# EAGLE design rpiabplusdogm128_1 (EAGLE 6.5.0)
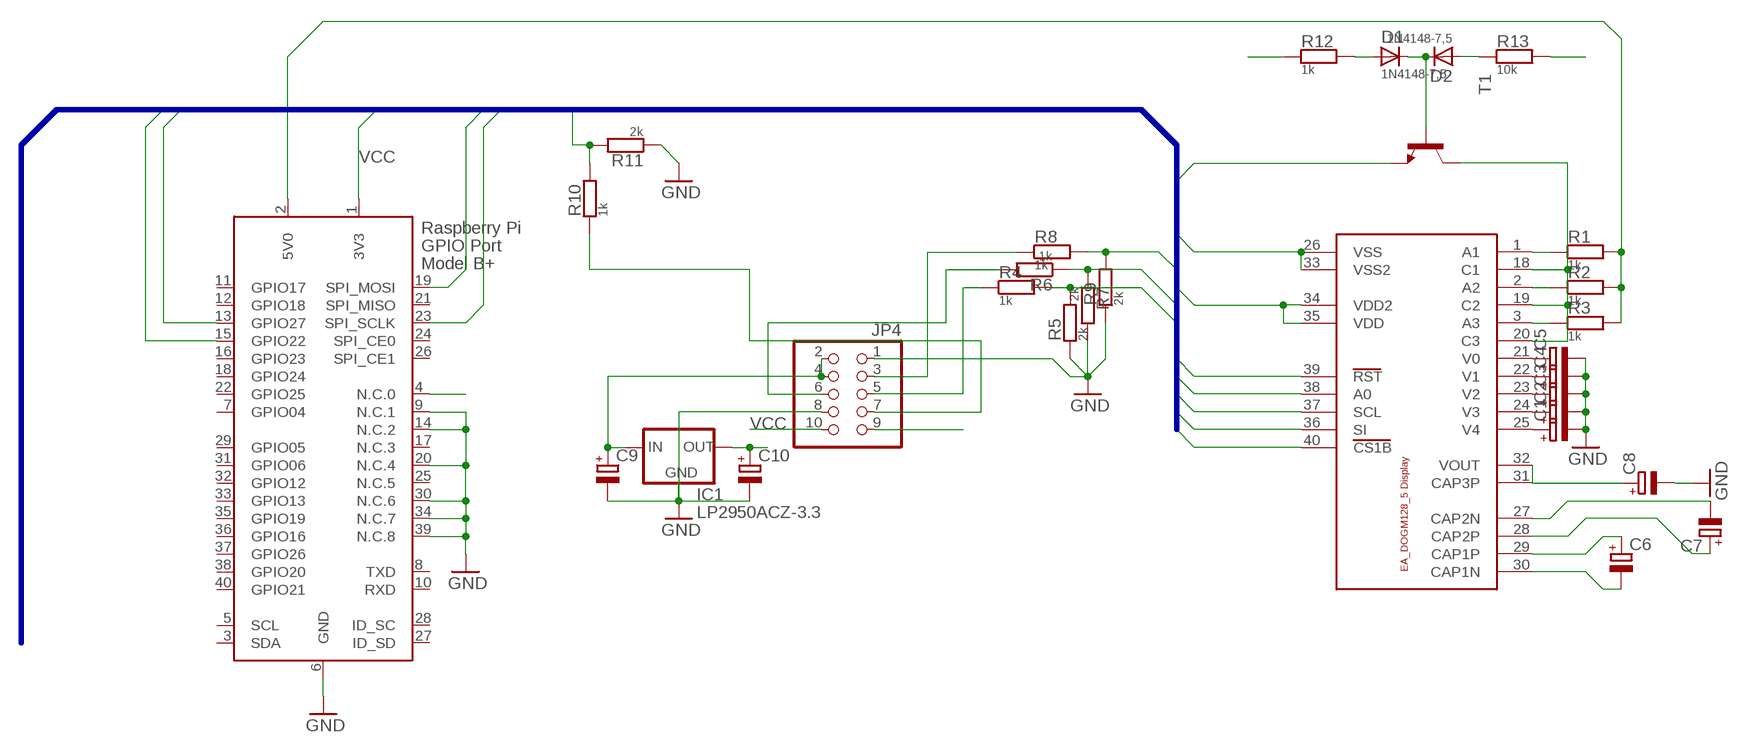
[diagram p0: schematic, sheet 1]

## Parts
C1  CPOL-EUA/3216-18W  [A/3216-18W]
C2  CPOL-EUA/3216-18W  [A/3216-18W]
C3  CPOL-EUA/3216-18W  [A/3216-18W]
C4  CPOL-EUA/3216-18W  [A/3216-18W]
C5  CPOL-EUA/3216-18W  [A/3216-18W]
C6  CPOL-EUA/3216-18W  [A/3216-18W]
C7  CPOL-EUA/3216-18W  [A/3216-18W]
C8  CPOL-EUA/3216-18W  [A/3216-18W]
C9  CPOL-EUA/3216-18W  [A/3216-18W]
C10  CPOL-EUA/3216-18W  [A/3216-18W]
D1  1N4148-7,5  [DO35-7,5]
D2  1N4148-7,5  [DO35-7,5]
IC1  LP2950ACZ-3.3  [TO92]
JP4  PINHD-2X5_2.54-SMD  [2X05SMD]
R1  1k  R_10  [R_10]
R2  1k  R_10  [R_10]
R3  1k  R_10  [R_10]
R4  1k  R_10  [R_10]
R5  2k  R_10  [R_10]
R6  1k  R_10  [R_10]
R7  2k  R_10  [R_10]
R8  1k  R_10  [R_10]
R9  2k  R_10  [R_10]
R10  1k  R_10  [R_10]
R11  2k  R_10  [R_10]
R12  1k  R_10  [R_10]
R13  10k  R_10  [R_10]
T1  BC817-16-NPN-SOT23-BEC  [SOT23-BEC]
U$1  EA_DOG-M_DISPLAY  [E_DOG-M_DISPLAY]
X2  RASPI_BOARD_B+_H  [RASPI_BOARD_B+HAT]

## Nets
5V: C9.+ IC1.3(IN) JP4.2 JP4.4 R1.2 R2.2 R3.2 X2.2(5V0) X2.4(N.C.0)
A0: R8.2 R9.2 U$1.38(A0) X2.15(GPIO22)
BELE: JP4.9 R12.1
BELK58B: JP4.10 R13.2
CS1B: U$1.40(CS1B)
GND: C1.- C2.- C3.- C4.- C5.- C8.- C9.- C10.- IC1.2(GND) JP4.1 JP4.8 R5.1 R7.2 R9.1 R11.1 T1.E U$1.26(VSS) U$1.33(VSS2) X2.6(GND) X2.9(N.C.1) X2.14(N.C.2) X2.20(N.C.4) X2.30(N.C.6) X2.34(N.C.7) X2.39(N.C.8)
N$2: C1.+ U$1.25(V4)
N$3: R1.1 U$1.1(A1)
N$4: R2.1 U$1.2(A2)
N$5: R3.1 U$1.3(A3)
N$6: T1.C U$1.18(C1) U$1.19(C2) U$1.20(C3)
N$7: JP4.7 R10.1
N$8: JP4.5 R4.1
N$9: JP4.6 R6.2
N$10: JP4.3 R8.1
N$14: D1.C D2.C T1.B
N$15: D2.A R13.1
N$16: D1.A R12.2
N$17: C2.+ U$1.24(V3)
N$18: C3.+ U$1.23(V2)
N$19: C4.+ U$1.22(V1)
N$20: C5.+ U$1.21(V0)
N$22: C8.+ U$1.31(CAP3P) U$1.32(VOUT)
N$23: C7.- U$1.27(CAP2N)
N$24: C7.+ U$1.28(CAP2P)
N$26: C6.+ U$1.29(CAP1P)
N$27: C6.- U$1.30(CAP1N)
RST: R10.2 R11.2 U$1.39(RST) X2.13(GPIO27)
SCL: R4.2 R5.2 U$1.37(SCL) X2.23(SPI_SCLK)
SI: R6.1 R7.1 U$1.36(SI) X2.19(SPI_MOSI)
VCC: C10.+ IC1.1(OUT) U$1.34(VDD2) U$1.35(VDD) X2.1(3V3)
Unconnected: X2.3(SDA) X2.5(SCL) X2.7(GPIO04) X2.8(TXD) X2.10(RXD) X2.11(GPIO17) X2.12(GPIO18) X2.16(GPIO23) X2.17(N.C.3) X2.18(GPIO24) X2.21(SPI_MISO) X2.22(GPIO25) X2.24(SPI_CE0) X2.25(N.C.5) X2.26(SPI_CE1) X2.27(ID_SD) X2.28(ID_SC) X2.29(GPIO05) X2.31(GPIO06) X2.32(GPIO12) X2.33(GPIO13) X2.35(GPIO19) X2.36(GPIO16) X2.37(GPIO26) X2.38(GPIO20) X2.40(GPIO21)

## Buses
CS1B,SI,SCL,A0,RST,GND,VCC,BACKLIGHT

## Library data of the parts
C1-C10 = rcl:CPOL-EU: POLARIZED CAPACITOR, European symbol
D1 D2 = 0_eigene:1N4148-7,5
IC1 = v-reg:LP2950?*: Source: http://cache.national.com/ds/LP/LP2950.pdf
JP4 = pinhead:PINHD-2X5: PIN HEADER
R1-R13 = 0_eigene:R_10
T1 = transistor:*-NPN-: NPN Transistror BF959 corrected 2008.03.06
U$1 = display_ea_dogm128:EA_DOG-M_DISPLAY
X2 = raspberrypi_bastelstube_v13:RASPI_BOARD_B+: Raspberry Pi GPIO connector with markings for the outer dimensions of the Raspberry Pi board model B+ with different sets of drill holes or mounting pads

## Board
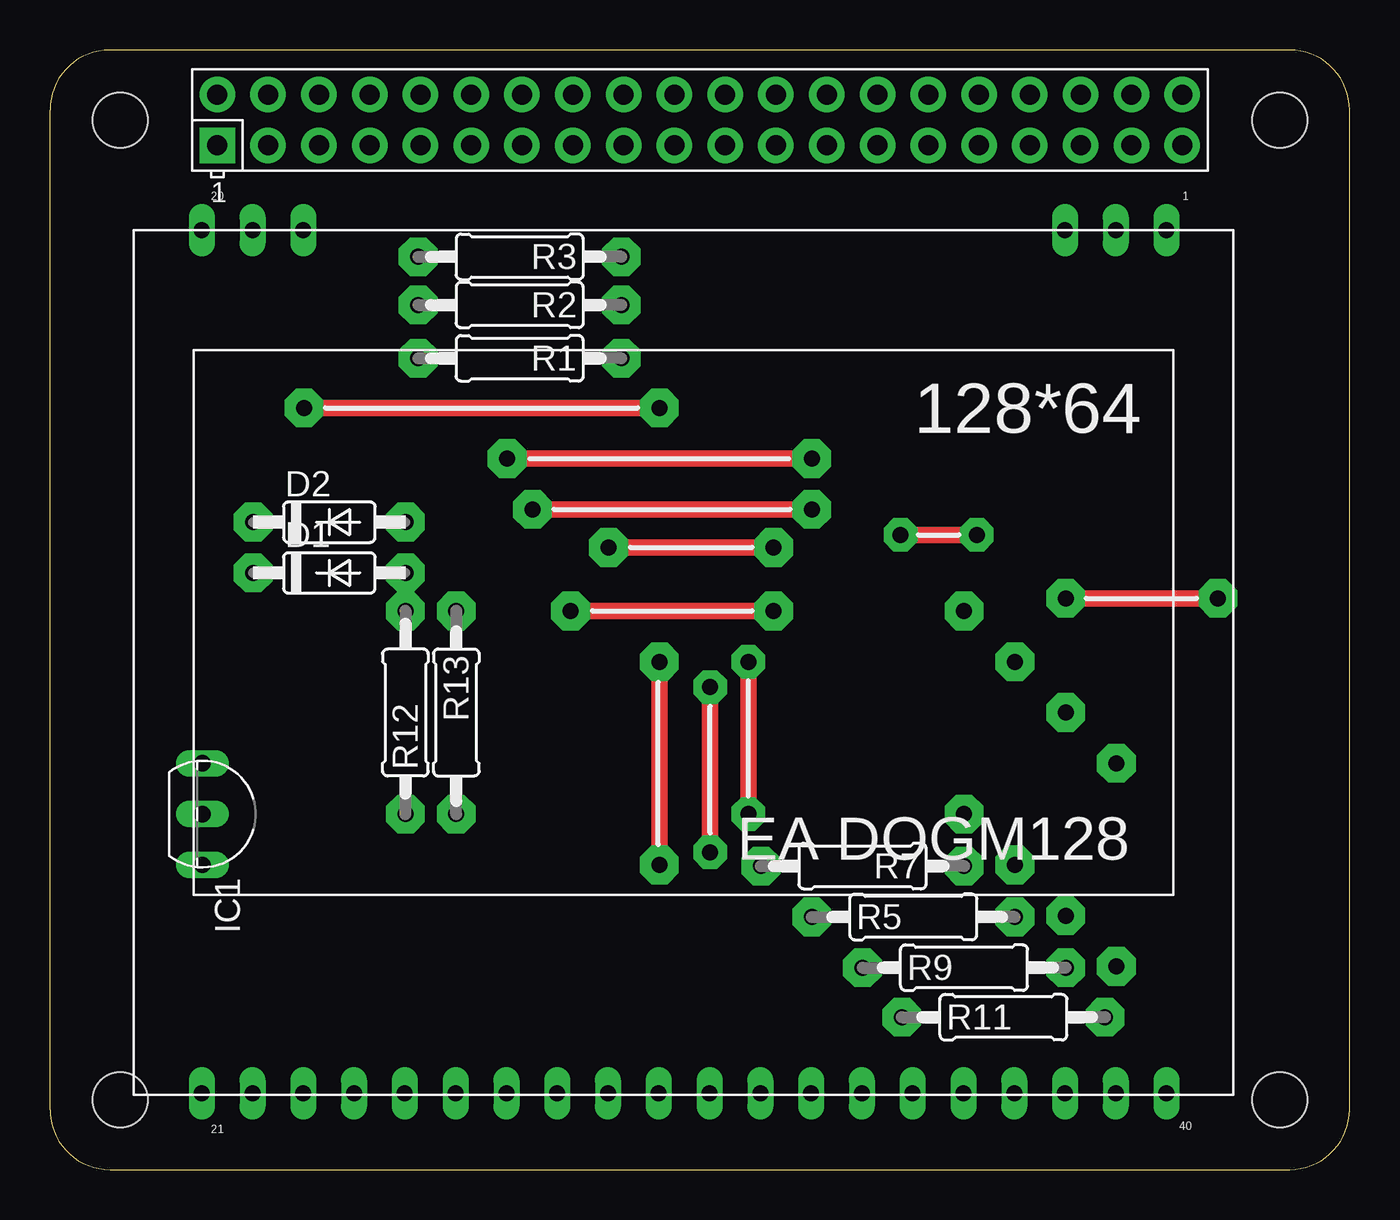
[diagram p1: board, top side]
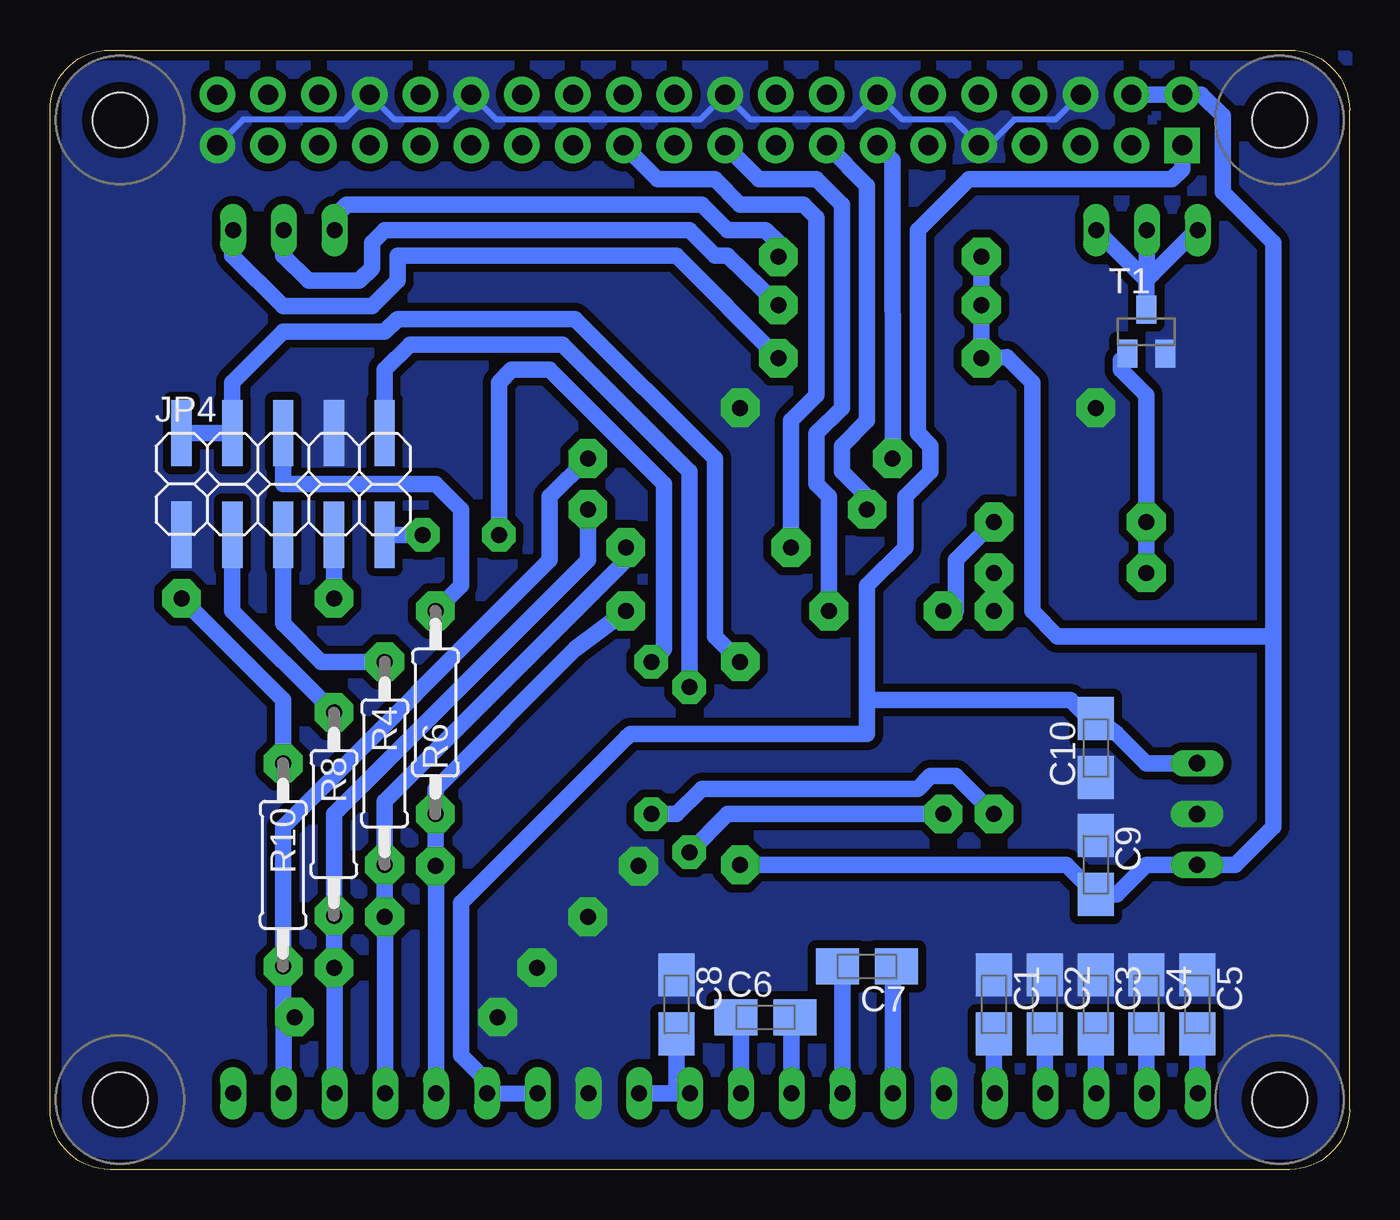
[diagram p2: board, bottom side, seen from below]

Size 65 x 56 mm. Coordinates in mm from the lower left corner, seen from the top.
Copper layers (1*16): Top 0.035mm / dielectric 1.5mm / Bottom 0.035mm
Design rules "default *": minimum track width 10mil, minimum drill 24mil, track to track 8mil, track to pad 8mil, pad to pad 8mil, via to via 8mil, smd to smd 8mil, copper to edge 20mil, drill to drill 8mil, minimum pad ring 10mil, minimum via ring 8mil, stop-mask expansion 4mil, vias tented up to drill 0mil, thermal gap 10mil

### Footprints (pad centres in the part's own frame; a part is rotated, then mirrored left to right if it is on the bottom)
A/3216-18W = smd 2.15 x 1.8: + 1.475,0; - -1.475,0
DO35-7,5 = drill 0.8 pad 1.93 octagon: A 3.81,0; C -3.81,0
TO92 = drill 0.813 long: 1 -2.54,0; 2 0,0; 3 2.54,0
2X05SMD = smd 1.016 x 3.302: 1 -1.27,-3.81; 2 -1.27,1.27; 3 1.27,-3.81; 4 1.27,1.27; 5 3.81,-3.81; 6 3.81,1.27; 7 6.35,-3.81; 8 6.35,1.27; 9 8.89,-3.81; 10 8.89,1.27
R_10 = drill 0.8 pad 1.93 octagon: 1 -5.08,0; 2 5.08,0
SOT23-BEC = smd 1 x 1.4: B -0.95,-1.1; C 0,1.1; E 0.95,-1.1
E_DOG-M_DISPLAY = drill 0.8 long: 1 0.032,0; 2 2.572,0; 3 5.112,0; 18 43.212,0; 19 45.752,0; 20 48.292,0; 21 48.292,43.18; 22 45.752,43.18; 23 43.212,43.18; 24 40.672,43.18; 25 38.132,43.18; 26 35.592,43.18; 27 33.052,43.18; 28 30.512,43.18; 29 27.972,43.18; 30 25.432,43.18; 31 22.892,43.18; 32 20.352,43.18; 33 17.812,43.18; 34 15.272,43.18; 35 12.732,43.18; 36 10.192,43.18; 37 7.652,43.18; 38 5.112,43.18; 39 2.572,43.18; 40 0.032,43.18
RASPI_BOARD_B+HAT = drill 1 pad 1.778 square: 1 8.37,51.23 | drill 1 pad 1.778: 2 8.37,53.77; 3 10.91,51.23; 4 10.91,53.77; 5 13.45,51.23; 6 13.45,53.77; 7 15.99,51.23; 8 15.99,53.77; 9 18.53,51.23; 10 18.53,53.77; 11 21.07,51.23; 12 21.07,53.77; 13 23.61,51.23; 14 23.61,53.77; 15 26.15,51.23; 16 26.15,53.77; 17 28.69,51.23; 18 28.69,53.77; 19 31.23,51.23; 20 31.23,53.77; 21 33.77,51.23; 22 33.77,53.77; 23 36.31,51.23; 24 36.31,53.77; 25 38.85,51.23; 26 38.85,53.77; 27 41.39,51.23; 28 41.39,53.77; 29 43.93,51.23; 30 43.93,53.77; 31 46.47,51.23; 32 46.47,53.77; 33 49.01,51.23; 34 49.01,53.77; 35 51.55,51.23; 36 51.55,53.77; 37 54.09,51.23; 38 54.09,53.77; 39 56.63,51.23; 40 56.63,53.77 | hole 2.75: 3.5,3.5; 3.5,52.5; 61.5,3.5; 61.5,52.5

### Placement (x,y rotation side)
C1  17.78,8.26 270 bottom
C2  15.24,8.26 270 bottom
C3  12.7,8.26 270 bottom
C4  10.16,8.26 270 bottom
C5  7.62,8.26 270 bottom
C6  29.21,7.62 0 bottom
C7  24.13,10.16 180 bottom
C8  33.66,8.26 270 bottom
C9  12.7,15.24 270 bottom
C10  12.7,21.08 90 bottom
D1  13.97,29.84 0 top
D2  13.97,32.38 0 top
IC1  7.62,17.78 270 top
JP4  57.15,35.56 0 bottom
R1  23.5,40.58 180 top
R2  23.5,43.24 180 top
R3  23.5,45.66 180 top
R4  48.26,20.32 270 bottom
R5  43.18,12.64 0 top
R6  45.72,22.86 90 bottom
R7  40.64,15.18 180 top
R8  50.8,17.78 270 bottom
R9  45.72,10.1 0 top
R10  53.34,15.24 270 bottom
R11  47.69,7.62 0 top
R12  17.78,22.86 90 top
R13  20.32,22.86 270 top
T1  10.16,41.91 0 bottom
U$1  55.88,46.99 180 top
X2  0,0 0 top

### Tracks (layer width: path | path; a pad name or v marks a point on that pad's centre or on a via)
5V  (via drill 0.8 pad 1.93)
  Top 0.813: v30.48,25.4 v30.48,15.24
  Bottom 0.813: 3.81,26.67 3.81,46.35 6.35,48.9 6.35,52.7 7.42,53.77 X2.2 X2.4 | 3.81,26.67 3.81,17.14 5.72,15.24 IC1.3 10.16,15.24 11.64,13.77 C9.+ 14.18,15.24 v30.48,15.24 | 3.81,26.67 14.61,26.67 15.88,27.94 15.88,39.37 17.14,40.64 R1.2 R2.2 R3.2 | v30.48,25.4 31.75,26.67 31.75,35.56 38.73,42.55 47.62,42.55 48.26,41.91 53.34,41.91 55.88,39.37 JP4.4 JP4.2
A0  (via drill 0.8 pad 1.93)
  Top 0.813: v38.1,33.02 v24.13,33.02
  Bottom 0.813: U$1.38 50.77,10.13 R9.2 R8.2 50.8,17.78 38.1,30.48 v38.1,33.02 | v24.13,33.02 24.13,33.66 25.4,34.92 25.4,36.2 24.13,37.47 24.13,49.21 X2.15
BELE  (via drill 0.8 pad 1.68)
  Top 0.813: v46.36,31.75 v42.55,31.75 | v34.93,17.78 v34.93,25.4
  Bottom 0.813: JP4.9 v46.36,31.75 | v42.55,31.75 42.55,39.37 41.91,40.01 40.01,40.01 34.29,34.29 34.29,26.04 v34.93,25.4 | R12.1 19.69,19.68 20.96,19.68 21.59,19.05 32.38,19.05 33.66,17.78 v34.93,17.78
BELK58B  (via drill 0.8 pad 1.68)
  Top 0.813: v33.02,15.88 v33.02,24.13
  Bottom 0.813: JP4.10 48.26,40.01 46.99,41.27 39.37,41.27 33.02,34.92 v33.02,24.13 | R13.2 31.12,17.78 v33.02,15.88
GND  (via drill 0.8 pad 1.93)
  Top 0.813: v30.48,38.1 v12.7,38.1
  Bottom 0.305: X2.6 14.71,52.51 16.76,52.51 18.05,51.23 X2.9 19.82,52.51 22.35,52.51 X2.14 24.87,52.51 29.97,52.51 X2.20 32.49,52.51 42.68,52.51 X2.30 45.19,52.51 47.75,52.51 X2.34 50.27,52.51 55.35,52.51 X2.39
  Bottom 0.813: JP4.8 50.8,36.2
  pour Bottom (isolate 0.406, no thermals): 0.13,55.69 64.13,55.56 64.13,0.44 0.13,0.57
N$2
  Bottom 0.813: C1.+ 17.78,3.84 U$1.25
N$3
  Bottom 0.813: R1.1 33.66,45.72 47.62,45.72 47.62,44.45 48.9,43.18 53.34,43.18 55.88,45.72 55.88,46.96 U$1.1
N$4
  Bottom 0.813: R2.1 31.12,45.72 31.75,45.72 33.02,46.99 48.26,46.99 48.9,46.35 48.9,45.09 49.53,44.45 52.07,44.45 53.34,45.72 53.34,46.96 U$1.2
N$5
  Bottom 0.813: R3.1 28.57,46.35 29.21,46.99 31.12,46.99 32.38,48.26 50.16,48.26 50.8,47.62 U$1.3
N$6
  Bottom 0.813: T1.C 10.16,44.48 | 10.16,44.48 U$1.18 | U$1.20 7.65,46.99 9.86,44.78 | 9.86,44.78 10.16,44.48 | U$1.19 10.13,45.05 9.86,44.78
N$7  (via drill 0.8 pad 1.93)
  Top 0.813: v58.42,28.57 v50.8,28.57
  Bottom 0.813: R10.1 53.34,23.5 v58.42,28.57 | v50.8,28.57 JP4.7
N$8
  Bottom 0.813: R4.1 51.44,25.4 53.34,27.3 JP4.5
N$9
  Bottom 0.813: R6.2 44.45,29.21 44.45,33.02 45.72,34.29 53.34,34.29 JP4.6
N$10
  Bottom 0.813: R8.1 55.88,27.94 JP4.3
N$14
  Bottom 0.813: D1.C D2.C 10.16,38.73 11.43,40.01 11.43,40.49 T1.B
N$15
  Bottom 0.813: R13.1 19.69,27.94 19.69,30.48 D2.A
N$16
  Bottom 0.813: R12.2 D1.A
N$17
  Bottom 0.813: C2.+ 15.24,3.84 U$1.24
N$18
  Bottom 0.813: C3.+ 12.7,3.84 U$1.23
N$19
  Bottom 0.813: C4.+ 10.16,3.84 U$1.22
N$20
  Bottom 0.813: C5.+ 7.62,3.84 U$1.21
N$22
  Bottom 0.813: C8.+ 33.66,3.81 | 33.66,3.81 U$1.31 | U$1.31 | U$1.32 34.29,3.81 33.66,3.81
N$23
  Bottom 0.813: U$1.27 22.83,9.99 C7.-
N$24
  Bottom 0.813: U$1.28 25.37,9.92 C7.+
N$26
  Bottom 0.813: U$1.29 27.91,7.45 C6.+
N$27
  Bottom 0.813: U$1.30 30.45,7.38 C6.-
RST  (via drill 0.8 pad 1.93)
  Top 0.813: v22.86,35.56 v38.1,35.56
  Bottom 0.813: U$1.39 53.31,7.59 R11.2 53.34,7.62 R10.2 53.34,17.14 40.01,30.48 40.01,33.66 v38.1,35.56 | v22.86,35.56 22.85,35.57 22.86,50.16 22.86,50.48 X2.13
SCL  (via drill 0.8 pad 1.93)
  Top 0.813: v36.2,31.11 v27.94,31.11
  Bottom 0.813: U$1.37 48.23,12.67 R5.2 R4.2 48.26,18.41 36.2,30.48 v36.2,31.11 | v27.94,31.11 27.94,37.47 26.67,38.73 26.67,47.62 27.3,48.26 30.48,48.26 31.75,49.53 34.61,49.53 X2.23
SI  (via drill 0.8 pad 1.93)
  Top 0.813: v36.2,27.94 v26.04,27.94
  Bottom 0.813: U$1.36 45.69,15.21 R7.1 R6.1 45.72,19.05 38.73,26.04 v36.2,27.94 | v26.04,27.94 26.04,33.66 26.67,34.29 26.67,36.83 25.4,38.1 25.4,48.26 26.67,49.53 29.53,49.53 X2.19
VCC
  Bottom 0.813: IC1.1 10.16,20.32 11.64,21.8 C10.+ 12.7,22.23 13.97,23.5 24.13,23.5 | 24.13,23.5 24.13,21.8 35.96,21.8 36.2,21.59 44.45,13.34 44.45,5.71 43.15,4.41 U$1.35 43.16,3.79 40.64,3.81 U$1.34 | 24.13,23.5 24.13,29.21 22.23,31.11 22.23,33.66 20.96,34.92 20.96,36.2 21.59,36.83 21.59,46.99 19.05,49.53 8.89,49.53 8.37,50.05 X2.1